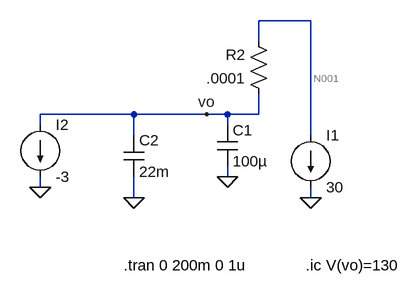
[diagram p0: schematic Supercap.asc]
Supercap.asc, the LTspice schematic file:
Version 4
SHEET 1 880 680
WIRE 432 -144 352 -144
WIRE 352 -112 352 -144
WIRE 160 0 16 0
WIRE 272 0 160 0
WIRE 304 0 272 0
WIRE 352 0 352 -32
WIRE 352 0 304 0
WIRE 16 16 16 0
WIRE 304 16 304 0
WIRE 160 32 160 0
WIRE 432 32 432 -144
WIRE 304 96 304 80
WIRE 16 112 16 96
WIRE 160 128 160 96
WIRE 432 128 432 112
FLAG 432 128 0
FLAG 272 0 vo
FLAG 160 128 0
FLAG 304 96 0
FLAG 16 112 0
SYMBOL cap 144 32 R0
SYMATTR InstName C2
SYMATTR Value 22m
SYMATTR SpiceLine V=160 Rser=.0113
SYMBOL res 368 -16 R180
WINDOW 0 36 76 Left 2
WINDOW 3 36 40 Left 2
SYMATTR InstName R2
SYMATTR Value .0001
SYMBOL cap 288 16 R0
SYMATTR InstName C1
SYMATTR Value 100µ
SYMBOL current 432 32 R0
WINDOW 123 0 0 Left 0
WINDOW 39 0 0 Left 0
SYMATTR InstName I1
SYMATTR Value 30
SYMBOL current 16 16 R0
WINDOW 123 0 0 Left 0
WINDOW 39 0 0 Left 0
SYMATTR InstName I2
SYMATTR Value -3
TEXT 144 232 Left 2 !.tran 0 200m 0 1u
TEXT 424 232 Left 2 !.ic V(vo)=130

The netlist it stands for:
* Supercap.asc
C2 vo 0 22m V=160 Rser=.0113
R2 vo N001 .0001
C1 vo 0 100µ
I1 N001 0 30
I2 vo 0 -3
.tran 0 200m 0 1u
.ic V(vo)=130
.backanno
.end

* Results of the author's LTspice run, read from the files saved beside the schematic
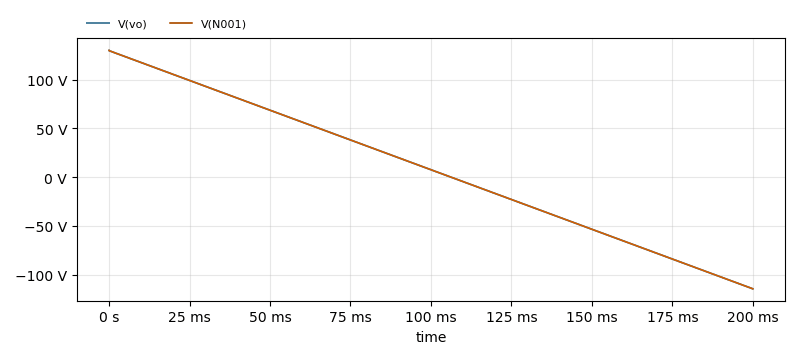
[diagram p1: Transient Analysis of Supercap.asc, plotted from the saved traces]
* Transient Analysis, 1 run:
*   V(vo): min -114.6 V, max 130 V, average 7.526 V, rms 70.94 V, last -114.6 V
*   V(N001): min -114.6 V, max 130 V, average 7.523 V, rms 70.94 V, last -114.6 V